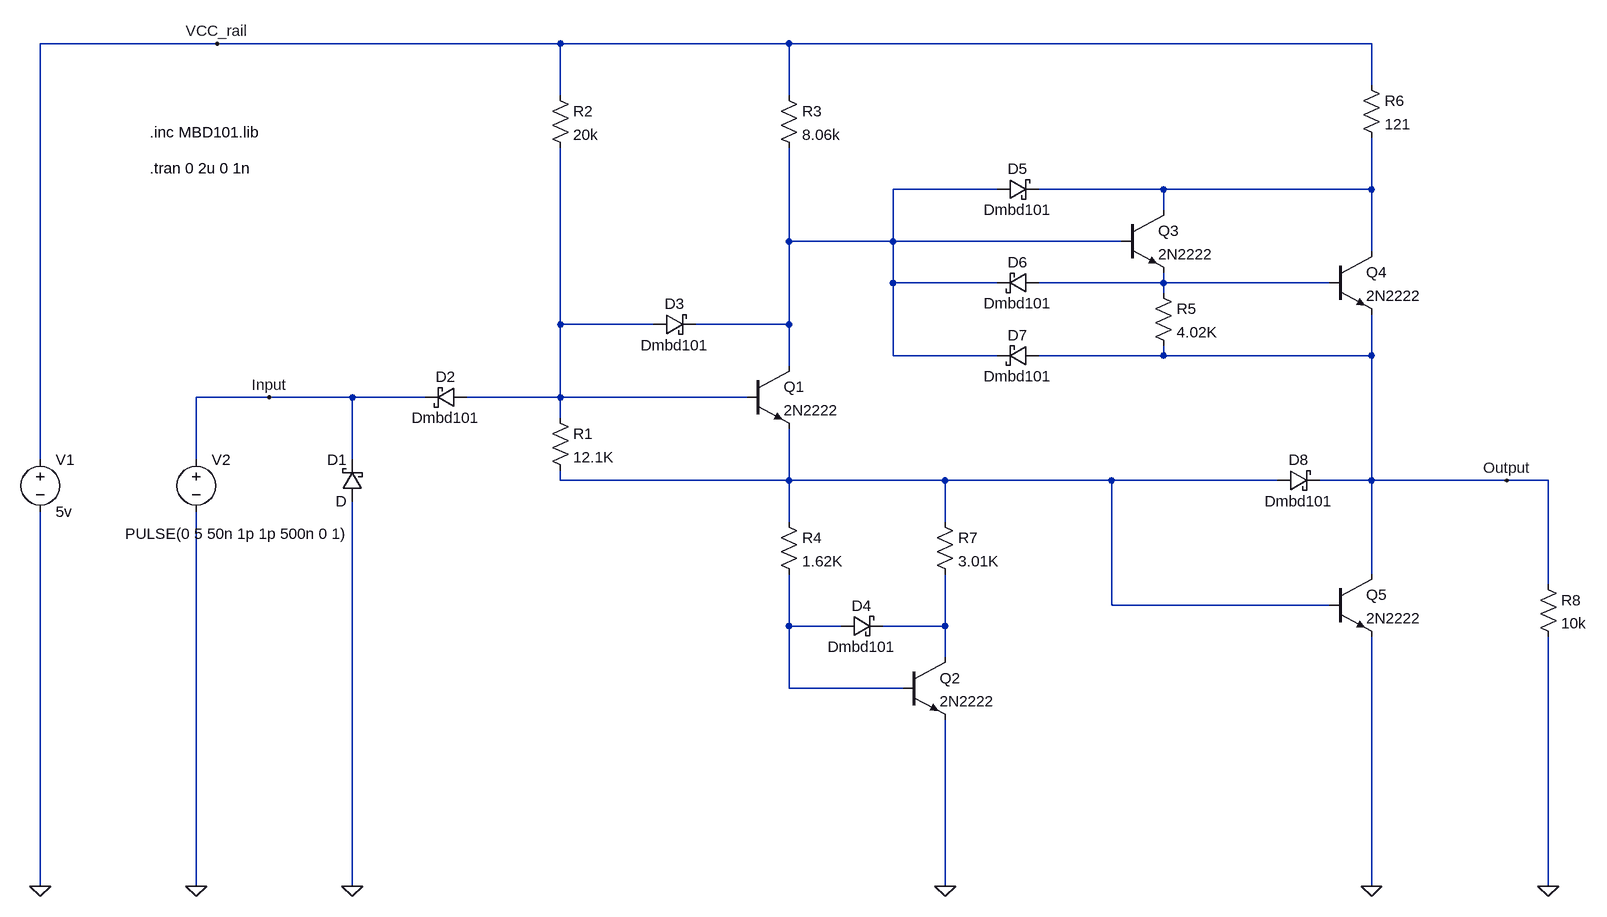
[diagram p0: schematic STTL.asc]
STTL.asc, the LTspice schematic file:
Version 4
SHEET 1 2292 804
WIRE 176 -512 -96 -512
WIRE 704 -512 176 -512
WIRE 1056 -512 704 -512
WIRE 1952 -512 1056 -512
WIRE 1952 -448 1952 -512
WIRE 704 -432 704 -512
WIRE 1056 -432 1056 -512
WIRE 1376 -288 1216 -288
WIRE 1632 -288 1440 -288
WIRE 1952 -288 1952 -368
WIRE 1952 -288 1632 -288
WIRE 1632 -256 1632 -288
WIRE 1056 -208 1056 -352
WIRE 1216 -208 1216 -288
WIRE 1216 -208 1056 -208
WIRE 1568 -208 1216 -208
WIRE 1952 -192 1952 -288
WIRE 1216 -144 1216 -208
WIRE 1376 -144 1216 -144
WIRE 1632 -144 1632 -160
WIRE 1632 -144 1440 -144
WIRE 1888 -144 1632 -144
WIRE 1632 -128 1632 -144
WIRE 704 -80 704 -352
WIRE 848 -80 704 -80
WIRE 1056 -80 1056 -208
WIRE 1056 -80 912 -80
WIRE 1216 -32 1216 -144
WIRE 1376 -32 1216 -32
WIRE 1632 -32 1632 -48
WIRE 1632 -32 1440 -32
WIRE 1952 -32 1952 -96
WIRE 1952 -32 1632 -32
WIRE 1056 -16 1056 -80
WIRE 256 32 144 32
WIRE 384 32 256 32
WIRE 496 32 384 32
WIRE 704 32 704 -80
WIRE 704 32 560 32
WIRE 992 32 704 32
WIRE 704 64 704 32
WIRE -96 128 -96 -512
WIRE 144 128 144 32
WIRE 384 128 384 32
WIRE 704 160 704 144
WIRE 1056 160 1056 80
WIRE 1056 160 704 160
WIRE 1296 160 1056 160
WIRE 1552 160 1296 160
WIRE 1808 160 1552 160
WIRE 1952 160 1952 -32
WIRE 1952 160 1872 160
WIRE 2160 160 1952 160
WIRE 2224 160 2160 160
WIRE 1056 224 1056 160
WIRE 1296 224 1296 160
WIRE 1952 304 1952 160
WIRE 2224 320 2224 160
WIRE 1552 352 1552 160
WIRE 1888 352 1552 352
WIRE 1056 384 1056 304
WIRE 1136 384 1056 384
WIRE 1296 384 1296 304
WIRE 1296 384 1200 384
WIRE 1296 432 1296 384
WIRE 1056 480 1056 384
WIRE 1232 480 1056 480
WIRE -96 784 -96 208
WIRE 144 784 144 208
WIRE 384 784 384 192
WIRE 1296 784 1296 528
WIRE 1952 784 1952 400
WIRE 2224 784 2224 400
FLAG -96 784 0
FLAG 144 784 0
FLAG 384 784 0
FLAG 1296 784 0
FLAG 1952 784 0
FLAG 2224 784 0
FLAG 176 -512 VCC_rail
FLAG 256 32 Input
FLAG 2160 160 Output
SYMBOL voltage -96 112 R0
SYMATTR InstName V1
SYMATTR Value 5v
SYMBOL voltage 144 112 R0
WINDOW 3 -109 130 Left 2
WINDOW 123 0 0 Left 2
WINDOW 39 0 0 Left 2
SYMATTR InstName V2
SYMATTR Value PULSE(0 5 50n 1p 1p 500n 0 1)
SYMBOL schottky 400 192 R180
WINDOW 0 24 64 Left 2
WINDOW 3 24 0 Left 2
SYMATTR InstName D1
SYMBOL schottky 560 16 R90
WINDOW 0 0 32 VBottom 2
WINDOW 3 32 32 VTop 2
SYMATTR InstName D2
SYMATTR Value Dmbd101
SYMBOL res 688 48 R0
SYMATTR InstName R1
SYMATTR Value 12.1K
SYMBOL res 688 -448 R0
SYMATTR InstName R2
SYMATTR Value 20k
SYMBOL res 1040 -448 R0
SYMATTR InstName R3
SYMATTR Value 8.06k
SYMBOL schottky 848 -64 R270
WINDOW 0 32 32 VTop 2
WINDOW 3 0 32 VBottom 2
SYMATTR InstName D3
SYMATTR Value Dmbd101
SYMBOL res 1040 208 R0
SYMATTR InstName R4
SYMATTR Value 1.62K
SYMBOL schottky 1136 400 R270
WINDOW 0 32 32 VTop 2
WINDOW 3 0 32 VBottom 2
SYMATTR InstName D4
SYMATTR Value Dmbd101
SYMBOL schottky 1376 -272 R270
WINDOW 0 32 32 VTop 2
WINDOW 3 0 32 VBottom 2
SYMATTR InstName D5
SYMATTR Value Dmbd101
SYMBOL schottky 1440 -160 R90
WINDOW 0 0 32 VBottom 2
WINDOW 3 32 32 VTop 2
SYMATTR InstName D6
SYMATTR Value Dmbd101
SYMBOL schottky 1440 -48 R90
WINDOW 0 0 32 VBottom 2
WINDOW 3 32 32 VTop 2
SYMATTR InstName D7
SYMATTR Value Dmbd101
SYMBOL res 1616 -144 R0
SYMATTR InstName R5
SYMATTR Value 4.02K
SYMBOL res 1936 -464 R0
SYMATTR InstName R6
SYMATTR Value 121
SYMBOL schottky 1808 176 R270
WINDOW 0 32 32 VTop 2
WINDOW 3 0 32 VBottom 2
SYMATTR InstName D8
SYMATTR Value Dmbd101
SYMBOL npn 992 -16 R0
SYMATTR InstName Q1
SYMATTR Value 2N2222
SYMBOL npn 1232 432 R0
SYMATTR InstName Q2
SYMATTR Value 2N2222
SYMBOL npn 1568 -256 R0
SYMATTR InstName Q3
SYMATTR Value 2N2222
SYMBOL npn 1888 -192 R0
SYMATTR InstName Q4
SYMATTR Value 2N2222
SYMBOL npn 1888 304 R0
SYMATTR InstName Q5
SYMATTR Value 2N2222
SYMBOL res 1280 208 R0
SYMATTR InstName R7
SYMATTR Value 3.01K
SYMBOL res 2208 304 R0
SYMATTR InstName R8
SYMATTR Value 10k
TEXT 72 -376 Left 2 !.inc MBD101.lib
TEXT 72 -320 Left 2 !.tran 0 2u 0 1n

The netlist it stands for:
* STTL.asc
V1 VCC_rail 0 5v
V2 Input 0 PULSE(0 5 50n 1p 1p 500n 0 1)
D1 0 Input D
D2 N004 Input Dmbd101
R1 N004 N005 12.1K
R2 VCC_rail N004 20k
R3 VCC_rail N001 8.06k
D3 N004 N001 Dmbd101
R4 N005 N006 1.62K
D4 N006 N007 Dmbd101
D5 N001 N002 Dmbd101
D6 N003 N001 Dmbd101
D7 Output N001 Dmbd101
R5 N003 Output 4.02K
R6 VCC_rail N002 121
D8 N005 Output Dmbd101
Q1 N001 N004 N005 0 2N2222
Q2 N007 N006 0 0 2N2222
Q3 N002 N001 N003 0 2N2222
Q4 N002 N003 Output 0 2N2222
Q5 Output N005 0 0 2N2222
R7 N005 N007 3.01K
R8 Output 0 10k
.model D D
.lib standard.dio
.model NPN NPN
.model PNP PNP
.lib standard.bjt
.inc MBD101.lib
.tran 0 2u 0 1n
.backanno
.end